# Altium schematic sheet ledsayici.SchDoc
size A4; SheetNumber: 1; SheetTotal: 1
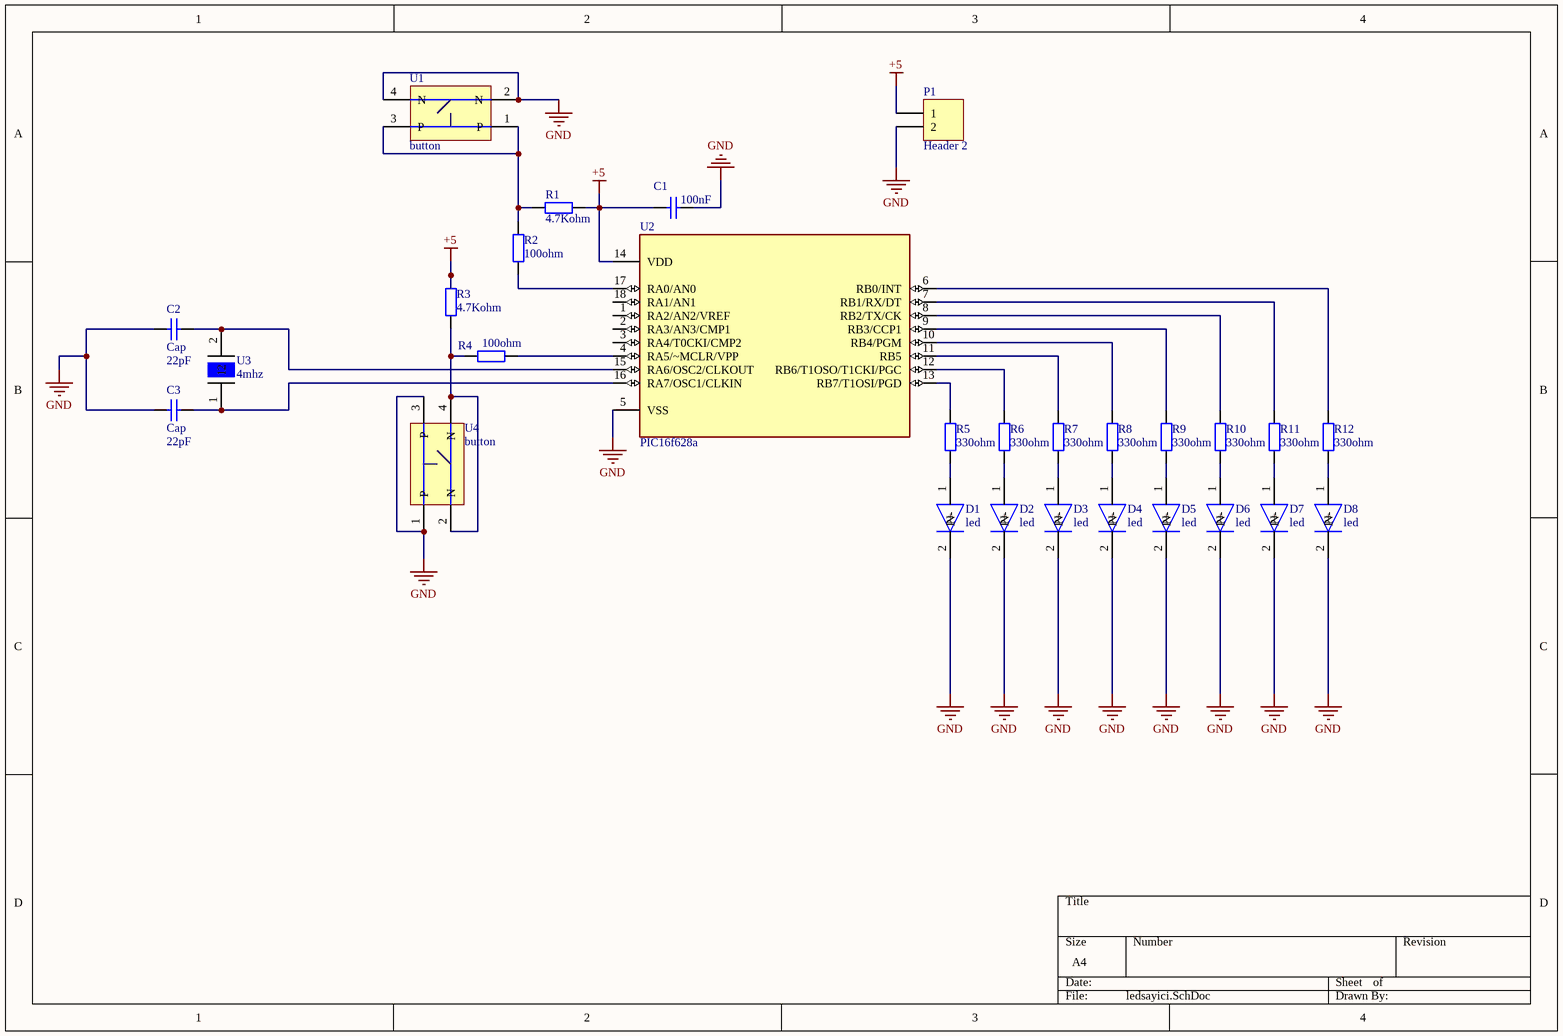
[diagram p0: ledsayici.SchDoc]

## Parts
C1  value 100nF  [RAD-0.3]  (hidden comment: Cap)
C2  Cap  value 22pF  [RAD-0.3]
C3  Cap  value 22pF  [RAD-0.3]
D1  led  [led]
D2  led  [led]
D3  led  [led]
D4  led  [led]
D5  led  [led]
D6  led  [led]
D7  led  [led]
D8  led  [led]
P1  Header 2  [HDR1X2]
R1  value 4.7Kohm  [AXIAL-0.4]  (hidden comment: Res2)
R2  value 100ohm  [AXIAL-0.4]  (hidden comment: Res2)
R3  value 4.7Kohm  [AXIAL-0.4]  (hidden comment: Res2)
R4  value 100ohm  [AXIAL-0.4]  (hidden comment: Res2)
R5  value 330ohm  [AXIAL-0.4]  (hidden comment: Res2)
R6  value 330ohm  [AXIAL-0.4]  (hidden comment: Res2)
R7  value 330ohm  [AXIAL-0.4]  (hidden comment: Res2)
R8  value 330ohm  [AXIAL-0.4]  (hidden comment: Res2)
R9  value 330ohm  [AXIAL-0.4]  (hidden comment: Res2)
R10  value 330ohm  [AXIAL-0.4]  (hidden comment: Res2)
R11  value 330ohm  [AXIAL-0.4]  (hidden comment: Res2)
R12  value 330ohm  [AXIAL-0.4]  (hidden comment: Res2)
U1  button  [buton]
U2  PIC16f628a  [PCBComponent_1]
U3  4mhz  [4mhz]
U4  button  [buton]

## Nets
+5: C1.1 P1.1 R1.1 R3.2 U2.14(VDD)
GND: C1.2 C2.1 C3.1 D1.2(N-) D2.2(N-) D3.2(N-) D4.2(N-) D5.2(N-) D6.2(N-) D7.2(N-) D8.2(N-) P1.2 U1.2(N) U1.4(N) U2.5(VSS) U4.1(P) U4.3(P)
NetC2_2: C2.2 U2.15(RA6/OSC2/CLKOUT) U3.2
NetC3_2: C3.2 U2.16(RA7/OSC1/CLKIN) U3.1
NetD1_1: D1.1(P+) R5.1
NetD2_1: D2.1(P+) R6.1
NetD3_1: D3.1(P+) R7.1
NetD4_1: D4.1(P+) R8.1
NetD5_1: D5.1(P+) R9.1
NetD6_1: D6.1(P+) R10.1
NetD7_1: D7.1(P+) R11.1
NetD8_1: D8.1(P+) R12.1
NetR1_2: R1.2 R2.2 U1.1(P) U1.3(P)
NetR2_1: R2.1 U2.17(RA0/AN0)
NetR3_1: R3.1 R4.1 U4.2(N) U4.4(N)
NetR4_2: R4.2 U2.4(RA5/~MCLR/VPP)
NetR5_2: R5.2 U2.13(RB7/T1OSI/PGD)
NetR6_2: R6.2 U2.12(RB6/T1OSO/T1CKI/PGC)
NetR7_2: R7.2 U2.11(RB5)
NetR8_2: R8.2 U2.10(RB4/PGM)
NetR9_2: R9.2 U2.9(RB3/CCP1)
NetR10_2: R10.2 U2.8(RB2/TX/CK)
NetR11_2: R11.2 U2.7(RB1/RX/DT)
NetR12_2: R12.2 U2.6(RB0/INT)

Not connected (* = marked no-connect by the designer): U2 1(RA2/AN2/VREF) 2(RA3/AN3/CMP1) 3(RA4/T0CKI/CMP2) 18(RA1/AN1)

## Library data of the parts
C1-C3 = Cap: Capacitor; Published: 8-Jun-2000; LatestRevisionDate: 17-Jul-2002; LatestRevisionNote: Re-released for DXP Platform.; PackageReference: RAD-0.3; Publisher: Altium Limited; PackageDescription: Radial Cap, Thru-Hole; 2 Leads; 0.3 in Pin Spacing
P1 = Header 2: Header, 2-Pin; LatestRevisionDate: 17-Jul-2002; LatestRevisionNote: Re-released for DXP Platform.; Publisher: Altium Limited
R1-R12 = Res2: Resistor; Published: 8-Jun-2000; LatestRevisionDate: 17-Jul-2002; LatestRevisionNote: Re-released for DXP Platform.; PackageReference: AXIAL-0.4; Publisher: Altium Limited; PackageDescription: Axial Device, Thru-Hole; 2 Leads; 0.4 in Pin Spacing